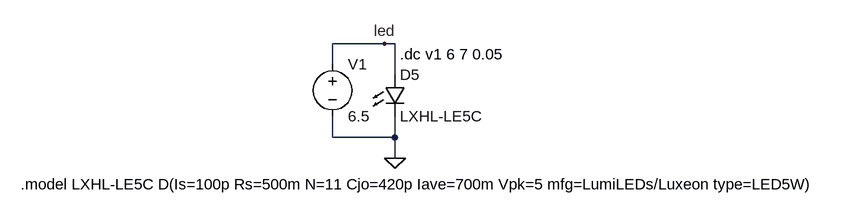
[diagram p0: schematic tstLE5C1.asc]
tstLE5C1.asc, the LTspice schematic file:
Version 4
SHEET 1 1752 680
WIRE 768 224 688 224
WIRE 784 224 768 224
WIRE 688 256 688 224
WIRE 784 272 784 224
WIRE 688 368 688 336
WIRE 784 368 784 336
WIRE 784 368 688 368
WIRE 784 400 784 368
FLAG 784 400 0
FLAG 768 224 led
SYMBOL LED 768 272 R0
SYMATTR InstName D5
SYMATTR Value LXHL-LE5C
SYMBOL voltage 688 240 R0
SYMATTR InstName V1
SYMATTR Value 6.5
TEXT 208 440 Left 0 !.model LXHL-LE5C D(Is=100p Rs=500m N=11 Cjo=420p Iave=700m Vpk=5 mfg=LumiLEDs/Luxeon type=LED5W)
TEXT 792 240 Left 0 !.dc v1 6 7 0.05

The netlist it stands for:
* tstLE5C1.asc
D5 led 0 LXHL-LE5C
V1 led 0 6.5
.model D D
.lib standard.dio
.model LXHL-LE5C D(Is=100p Rs=500m N=11 Cjo=420p Iave=700m Vpk=5 mfg=LumiLEDs/Luxeon type=LED5W)
.dc v1 6 7 0.05
.backanno
.end